# Altium schematic sheet Filter.SchDoc
size A4; SheetNumber: 3; SheetTotal: 5
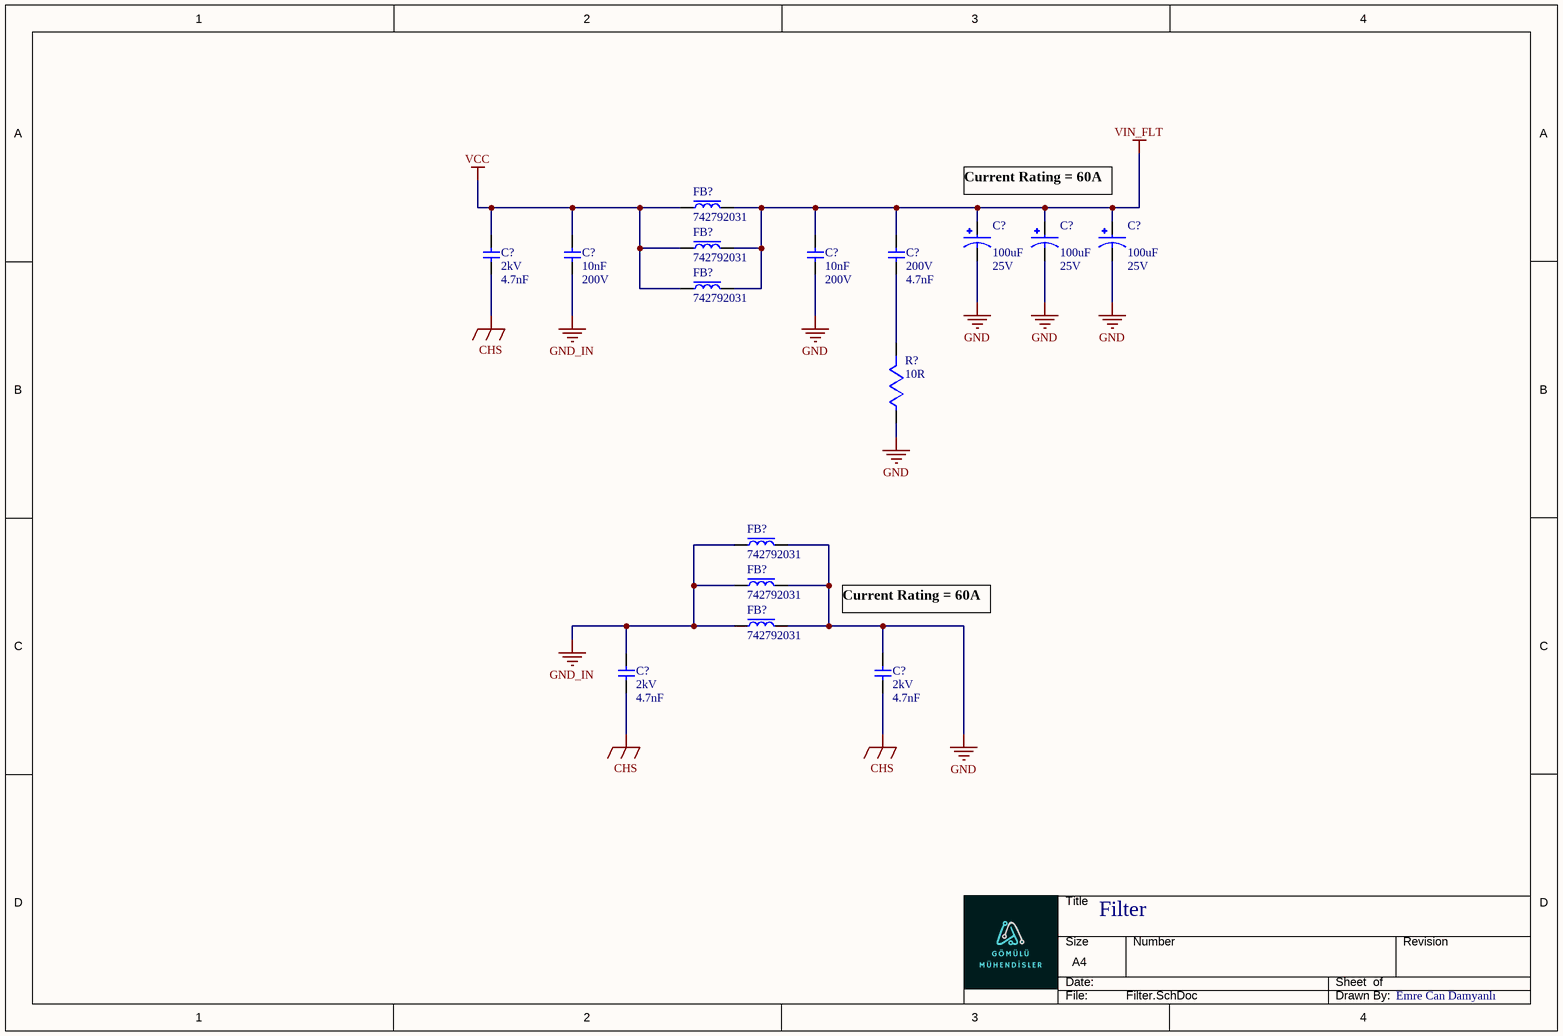
[diagram p0: Filter.SchDoc]

## Parts
(Parts that share a designator on the sheet are numbered #1, #2 ... from top to bottom, then left to right.)
C?#1  value 4.7nF  Voltage Rating (DC): 2kV  [CAPC4532X155N]  (hidden comment: C1812C472KGRACAUTO)
C?#2  value 10nF  Voltage: 200V  [CAPC3216X160N]  (hidden comment: C1206C103K2REC7800)
C?#3  value 10nF  Voltage: 200V  [CAPC3216X160N]  (hidden comment: C1206C103K2REC7800)
C?#4  value 4.7nF  Voltage Rating: 200V  (hidden comment: C1206C472J2GECAUTO)
C?#5  value 100uF  Voltage: 25V  (hidden comment: T491X107K025AT)
C?#6  value 100uF  Voltage: 25V  (hidden comment: T491X107K025AT)
C?#7  value 100uF  Voltage: 25V  (hidden comment: T491X107K025AT)
C?#8  value 4.7nF  Voltage Rating (DC): 2kV  [CAPC4532X155N]  (hidden comment: C1812C472KGRACAUTO)
C?#9  value 4.7nF  Voltage Rating (DC): 2kV  [CAPC4532X155N]  (hidden comment: C1812C472KGRACAUTO)
FB?#1  742792031  [BLE32SN120SH1L]
FB?#2  742792031  [BLE32SN120SH1L]
FB?#3  742792031  [BLE32SN120SH1L]
FB?#4  742792031  [BLE32SN120SH1L]
FB?#5  742792031  [BLE32SN120SH1L]
FB?#6  742792031  [BLE32SN120SH1L]
R?  value 10R  [RESISTOR_0603]  (hidden comment: RC0603FR-0710RL)

## Nets
CHS: C?#1.1 C?#8.1 C?#9.1
GND: C?#3.1 C?#5.2 C?#6.2 C?#7.2 C?#9.2 FB?#4.2 FB?#5.2 FB?#6.2 R?.1
GND_IN: C?#2.1 C?#8.2 FB?#4.1 FB?#5.1 FB?#6.1
VCC: C?#1.2 C?#2.2 FB?#1.1 FB?#2.1 FB?#3.1
VIN_FLT: C?#3.2 C?#4.2 C?#5.1 C?#6.1 C?#7.1 FB?#1.2 FB?#2.2 FB?#3.2
NetC?#4_1: C?#4.1 R?.2

## Notes on the sheet
- (near C?#5) Current Rating = 60A
- Current Rating = 60A
- Filter
- Emre Can Damyanlı

## Library data of the parts
C?#1 C?#8 C?#9 = C1812C472KGRACAUTO: Ceramic Capacitor, Multilayer, Ceramic, 2000V, 10% +Tol, 10% -Tol, X7R, 15% TC, 0.0047uF, 1812; Manufacturer: KEMET; Dielectric Material: 4241ConductorMaterial; Dielectric: 1511DielectricType; Supplier: Digi-Key; Supplier Part Number: 399-16791-1-ND; Manufacturer Part Number: C1812C472KGRACAUTO; RoHS: Yes; Category: Ceramic Capacitors; Stock: 3537; Pricing: 1=0,73, 10=0,508, 50=0,4278, 100=0,3484, 500=0,29034 (USD); ComponentLink1URL: https://datasheet.octopart.com/C1812C472KGRACAUTO-KEMET-datasheet-169967039.pdf?src-supplier=Newark; ComponentLink1Description: https://datasheet.octopart.com/C1812C472KGRACAUTO-KEMET-datasheet-169967039.pdf?src-supplier=Newark; ComponentLink2URL: https://api.kemet.com/component-edge/download/datasheet/C1812C472KGRACAUTO.pdf?src-supplier=Digi-Key; ComponentLink2Description: https://api.kemet.com/component-edge/download/datasheet/C1812C472KGRACAUTO.pdf?src-supplier=Digi-Key
C?#2 C?#3 = C1206C103K2REC7800: Cap Cer 1206 10NF 200V X7R 10%; Manufacturer: KEMET; Supplier: Digi-Key; Supplier Part Number: 399-C1206C103K2REC7800CT-ND; Manufacturer Part Number: C1206C103K2REC7800; RoHS: No; Category: Ceramic Capacitors; Stock: 7100; Pricing: 1=0,2, 10=0,127, 50=0,0804, 100=0,0643, 500=0,04642, 1000=0,04107 (USD)
C?#4 = C1206C472J2GECAUTO: Cap Cer 1206 4.7NF 200V C0G 5%; Manufacturer: KEMET; Supplier: Digi-Key; Supplier Part Number: 399-C1206C472J2GECAUTOCT-ND; Manufacturer Part Number: C1206C472J2GECAUTO; RoHS: Yes; Category: Ceramic Capacitors; Stock: 3910; Pricing: 1=0,43, 10=0,285, 50=0,21, 100=0,171, 500=0,135, 1000=0,114 (USD); Mounting Technology: Surface Mount; Case/Package: 1206; Min Operating Temperature: -55°C; Max Operating Temperature: 125°C; Series: ESD SMD Auto C0G; Packaging: Tape and Reel; Tolerance: 5%; Ratings: AEC-Q200; RoHS Compliant: Yes; ComponentLink1URL: https://api.kemet.com/component-edge/download/datasheet/C1206C472J2GECAUTO.pdf?src-supplier=Digi-Key; ComponentLink1Description: https://api.kemet.com/component-edge/download/datasheet/C1206C472J2GECAUTO.pdf?src-supplier=Digi-Key
C?#5-C?#7 = T491X107K025AT: Cap Tant Solid 100uF 25V X CASE 10% (7.3 X 4.3 X 4mm) Inward L SMD 7343-43 0.3 Ohm 125C T/R; Manufacturer: KEMET; Supplier: Digi-Key; Supplier Part Number: 399-8410-1-ND; Manufacturer Part Number: T491X107K025AT; RoHS: No; Category: Tantalum Capacitors; Stock: 45968; Pricing: 1=2,88, 10=2,328, 50=2,0316, 100=1,7776 (USD); ComponentLink1URL: https://datasheet.ciiva.com/28571/1854511-28571717.pdf?src-supplier=Element14; ComponentLink1Description: https://datasheet.ciiva.com/28571/1854511-28571717.pdf?src-supplier=Element14; ComponentLink2URL: https://datasheet.ciiva.com/6229/kem-t2005-t491-6229625.pdf?src-supplier=Digi-Key; ComponentLink2Description: https://datasheet.ciiva.com/6229/kem-t2005-t491-6229625.pdf?src-supplier=Digi-Key; ComponentLink3URL: https://datasheet.ciiva.com/6229/kem-t2005-t491-6229626.pdf?src-supplier=Digi-Key; ComponentLink3Description: https://datasheet.ciiva.com/6229/kem-t2005-t491-6229626.pdf?src-supplier=Digi-Key; ComponentLink4URL: https://datasheet.ciiva.com/6229/kem-t2005-t491-6229627.pdf?src-supplier=Digi-Key; ComponentLink4Description: https://datasheet.ciiva.com/6229/kem-t2005-t491-6229627.pdf?src-supplier=Digi-Key; ComponentLink5URL: https://datasheet.ciiva.com/22716/1854511-22716393.pdf?src-supplier=Element14; ComponentLink5Description: https://datasheet.ciiva.com/22716/1854511-22716393.pdf?src-supplier=Element14; ComponentLink6URL: https://datasheet.ciiva.com/22716/1854511-22716394.pdf?src-supplier=Element14; ComponentLink6Description: https://datasheet.ciiva.com/22716/1854511-22716394.pdf?src-supplier=Element14
FB?#1-FB?#6 = BLE32SN120SH1L: 12 Ohms @ 100 MHz 1 Power Line Ferrite Bead 1210 (3225 Metric) 20A 0.6mOhm; Manufacturer Part Number: 742792031
R? = RC0603FR-0710RL: SMD Chip Resistor, 10 Ohm, ± 1%, 100 mW, 0603 [1608 Metric], Thick Film, General Purpose; Manufacturer: Yageo; Voltage Rating (DC): 50V; Temperature Coefficient: 200ppm/°C; Max Power Dissipation: 100mW; Supplier: Digi-Key; Supplier Part Number: 311-10.0HRCT-ND; Manufacturer Part Number: RC0603FR-0710RL; RoHS: Yes; Category: Chip SMD Resistors; Stock: 1593496; Pricing: 1=0,1, 10=0,028, 50=0,018, 100=0,015, 500=0,0104, 1000=0,00901 (USD); Case/Package: 0603; Pins: 2; Case Code (Imperial): 0603; Case Code (Metric): 1608; Contact Plating: Tin,Matte; Min Operating Temperature: -55°C; Max Operating Temperature: 155°C; Packaging: Tape and Reel; Tolerance: 1%; Features: Moisture Resistant; Series: RC; Number of Terminations: 2; Power Rating: 100mW; Voltage Rating: 50V; Termination: SMD/SMT; Resistor Type: Thick Film; Resistance Tolerance: 1%; Construction: Rectangular; Technology: THICK FILM; Voltage Rating (AC): 50V; Length: 1.6mm; Width: 0.8mm; Height: 0.45mm; Depth: 0.8mm; Lead Free: Lead Free; RoHS Compliant: Yes; Reach SVHC Compliant: No; Military Standard: Not; ComponentLink1URL: https://datasheet.ciiva.com/11808/0900766b80f96399-11808140.pdf?src-supplier=Rs; ComponentLink1Description: https://datasheet.ciiva.com/11808/0900766b80f96399-11808140.pdf?src-supplier=Rs; ComponentLink2URL: https://datasheet.ciiva.com/7746/443971-7746245.pdf?src-supplier=Element14; ComponentLink2Description: https://datasheet.ciiva.com/7746/443971-7746245.pdf?src-supplier=Element14; ComponentLink3URL: https://datasheet.ciiva.com/8891/pyu-rc0603-51-rohs-l-4-8891285.pdf?src-supplier=Avnet; ComponentLink3Description: https://datasheet.ciiva.com/8891/pyu-rc0603-51-rohs-l-4-8891285.pdf?src-supplier=Avnet